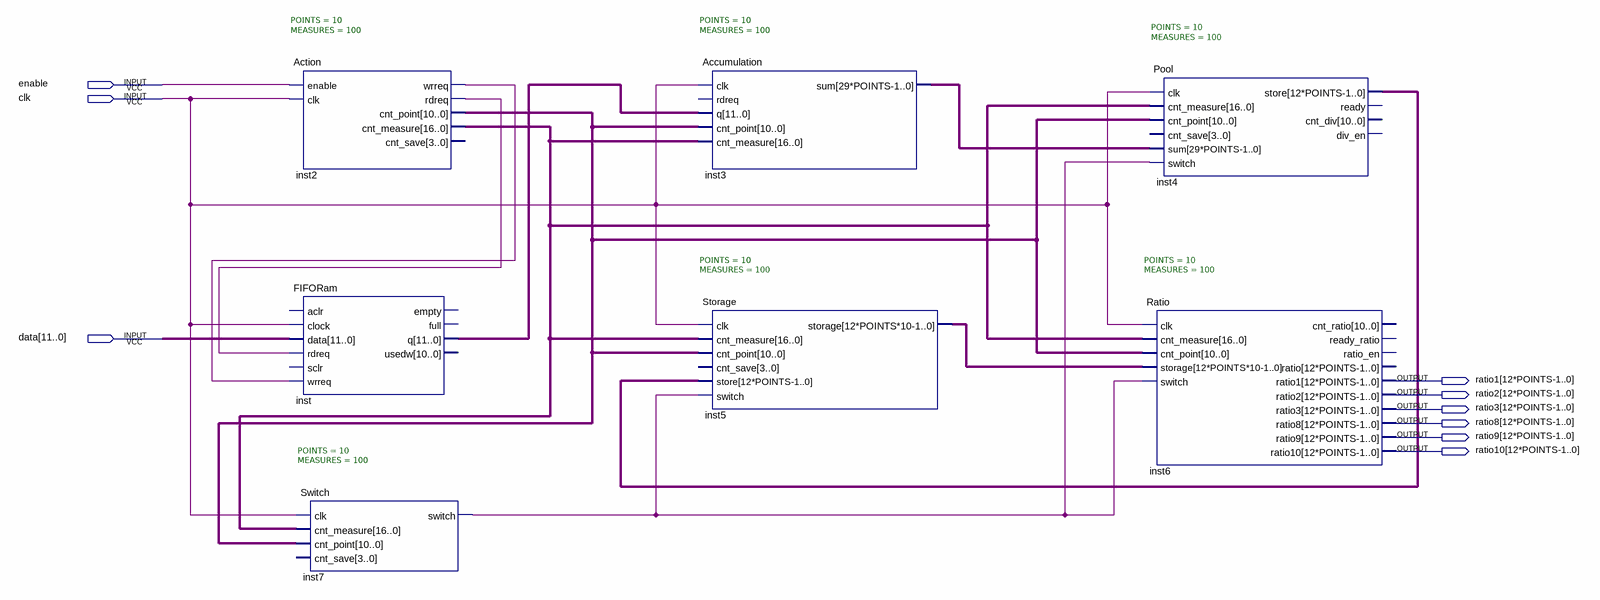
[diagram p0: schematic sheet]
// Quartus schematic RamanScheme.bdf as structural Verilog: 7 symbols, 9 pins
module RamanScheme (
  input  enable,
  input  clk,
  input  [11:0] data,
  output \ratio1[12*POINTS-1..0] ,
  output \ratio2[12*POINTS-1..0] ,
  output \ratio3[12*POINTS-1..0] ,
  output \ratio8[12*POINTS-1..0] ,
  output \ratio9[12*POINTS-1..0] ,
  output \ratio10[12*POINTS-1..0] 
);

  wire inst2_rdreq, inst2_wrreq, inst7_switch;
  wire [10:0] inst2_cnt_point;
  wire [11:0] inst_q;
  wire [16:0] inst2_cnt_measure;
  wire [119:0] inst4_store;
  wire [289:0] inst3_sum;
  wire [1199:0] inst5_storage;

  Action #(.POINTS(10), .MEASURES(100)) inst2 (
    .enable(enable), .clk(clk), .wrreq(inst2_wrreq), .rdreq(inst2_rdreq), .cnt_point(inst2_cnt_point),
    .cnt_measure(inst2_cnt_measure));  // open: cnt_save
  FIFORam inst (
    .clock(clk), .data(data), .rdreq(inst2_rdreq), .wrreq(inst2_wrreq), .q(inst_q));  // open: aclr, sclr, empty, full, usedw
  Switch #(.POINTS(10), .MEASURES(100)) inst7 (
    .clk(clk), .cnt_measure(inst2_cnt_measure), .cnt_point(inst2_cnt_point), .switch(inst7_switch));  // open: cnt_save
  Accumulation #(.POINTS(10), .MEASURES(100)) inst3 (
    .clk(clk), .q(inst_q), .cnt_point(inst2_cnt_point), .cnt_measure(inst2_cnt_measure), .sum(inst3_sum));  // open: rdreq
  Storage #(.POINTS(10), .MEASURES(100)) inst5 (
    .clk(clk), .cnt_measure(inst2_cnt_measure), .cnt_point(inst2_cnt_point), .store(inst4_store),
    .switch(inst7_switch), .storage(inst5_storage));  // open: cnt_save
  Ratio #(.POINTS(10), .MEASURES(100)) inst6 (
    .clk(clk), .cnt_measure(inst2_cnt_measure), .cnt_point(inst2_cnt_point), .storage(inst5_storage),
    .switch(inst7_switch), .ratio1(\ratio1[12*POINTS-1..0] ), .ratio2(\ratio2[12*POINTS-1..0] ),
    .ratio3(\ratio3[12*POINTS-1..0] ), .ratio8(\ratio8[12*POINTS-1..0] ), .ratio9(\ratio9[12*POINTS-1..0] ),
    .ratio10(\ratio10[12*POINTS-1..0] ));  // open: cnt_ratio, ready_ratio, ratio_en, ratio
  Pool #(.POINTS(10), .MEASURES(100)) inst4 (
    .clk(clk), .cnt_measure(inst2_cnt_measure), .cnt_point(inst2_cnt_point), .sum(inst3_sum),
    .switch(inst7_switch), .store(inst4_store));  // open: cnt_save, ready, cnt_div, div_en
endmodule
